# EAGLE schematic BISMILLAH PCG (EAGLE 9.6.2)
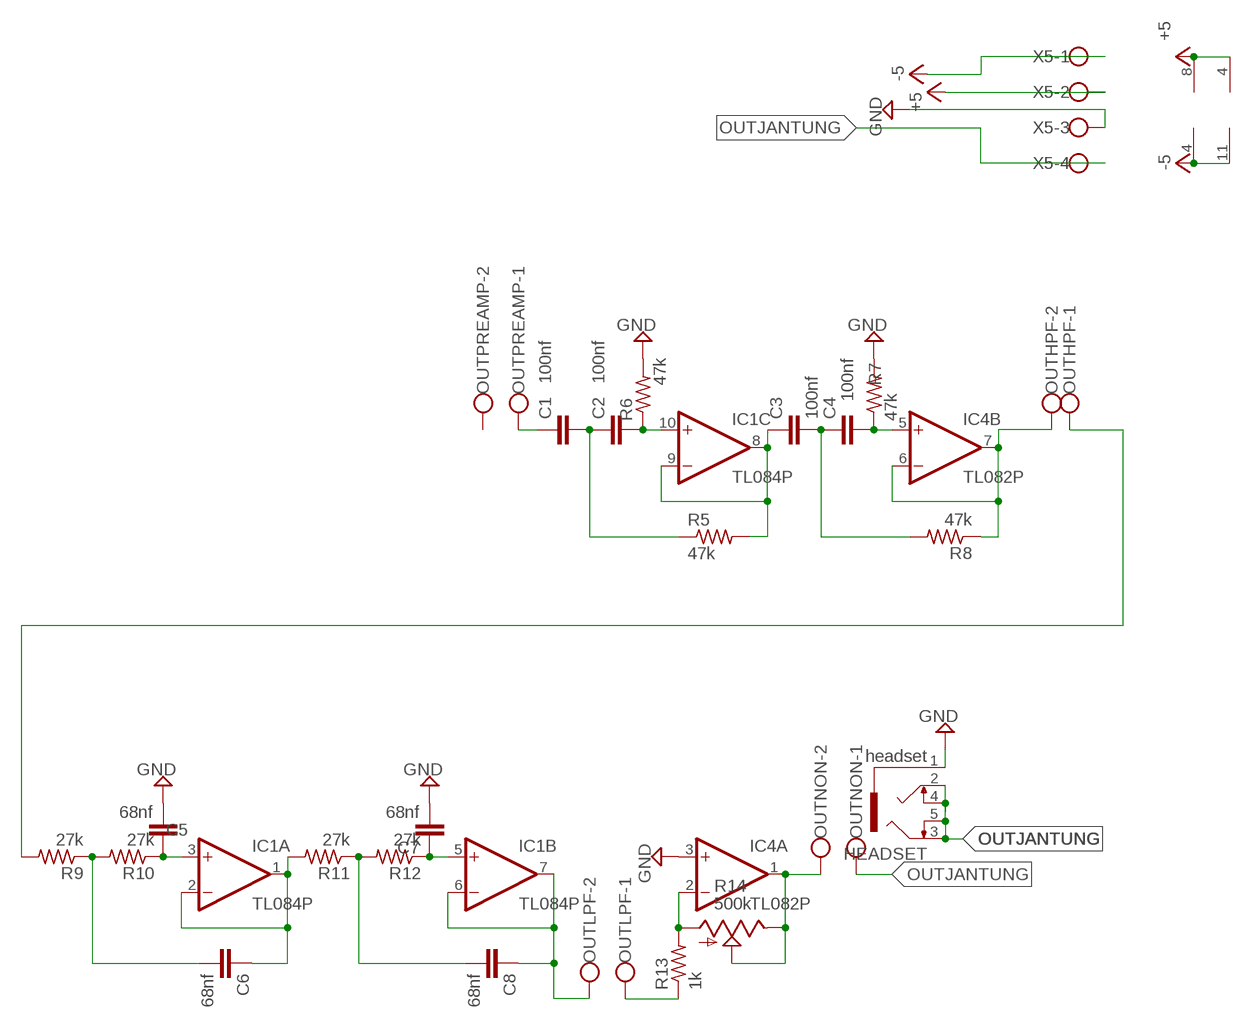
[diagram p0: schematic, sheet 1]

## Parts
C1  100nf  C-EU050-025X075  [C050-025X075]
C2  100nf  C-EU050-025X075  [C050-025X075]
C3  100nf  C-EU050-025X075  [C050-025X075]
C4  100nf  C-EU050-025X075  [C050-025X075]
C5  68nf  C-EU050-025X075  [C050-025X075]
C6  68nf  C-EU050-025X075  [C050-025X075]
C7  68nf  C-EU050-025X075  [C050-025X075]
C8  68nf  C-EU050-025X075  [C050-025X075]
HEADSET  headset  1503_09  [1503_09]
IC1  TL084P  [DIL14]
IC4  TL082P  [DIL08]
OUTHPF  W237-102  [W237-102]
OUTLPF  W237-102  [W237-102]
OUTNON  W237-102  [W237-102]
OUTPREAMP  W237-102  [W237-102]
R5  47k  R-US_0207/7  [0207/7]
R6  47k  R-US_0207/7  [0207/7]
R7  47k  R-US_0207/7  [0207/7]
R8  47k  R-US_0207/7  [0207/7]
R9  27k  R-US_0207/7  [0207/7]
R10  27k  R-US_0207/7  [0207/7]
R11  27k  R-US_0207/7  [0207/7]
R12  27k  R-US_0207/7  [0207/7]
R13  1k  R-US_0207/7  [0207/7]
R14  500k  TRIM_US-B64Y  [B64Y]
X5  W237-4  [W237-4]

## Nets
GND: C5.2 C7.2 HEADSET.1 IC4.3(A:+IN) R6.2 R7.2 X5.3
N$4: C1.1 OUTPREAMP.1
N$6: IC4.1(A:OUT) OUTNON.2 R14.E R14.S
N$7: C1.2 C2.1 R5.1
N$8: C2.2 IC1.10(C:+IN) R6.1
N$9: C3.1 IC1.8(C:OUT) IC1.9(C:-IN) R5.2
N$10: C3.2 C4.1 R8.2
N$11: C4.2 IC4.5(B:+IN) R7.1
N$12: IC4.6(B:-IN) IC4.7(B:OUT) OUTHPF.2 R8.1
N$13: C6.2 R9.1 R10.2
N$14: C5.1 IC1.3(A:+IN) R10.1
N$15: C6.1 IC1.1(A:OUT) IC1.2(A:-IN) R11.2
N$16: C8.2 R11.1 R12.2
N$17: C7.1 IC1.5(B:+IN) R12.1
N$18: C8.1 IC1.6(B:-IN) IC1.7(B:OUT) OUTLPF.2
N$19: IC4.2(A:-IN) R13.2 R14.A
N$20: OUTHPF.1 R9.2
N$23: OUTLPF.1 R13.1
OUTJANTUNG: HEADSET.2 HEADSET.3 HEADSET.4 HEADSET.5 OUTNON.1 X5.4
V-: IC1.11(P:V-) IC4.4(P:V-) X5.1 ; supply symbol labelled -5
VCC: IC1.4(P:V+) IC4.8(P:V+) X5.2 ; supply symbol labelled +5
Unconnected: IC1.12(D:+IN) IC1.13(D:-IN) IC1.14(D:OUT) OUTPREAMP.2

## Library data of the parts
C1-C8 = rcl:C-EU: CAPACITOR, European symbol; SPICEPREFIX: C
HEADSET = con-lumberg:1503_09: Jack connectors according to JISC 6560, 3.5 mm Klinkeneinbaukupplung nach JISC 6560, 3,5 mm, 3-polig/ stereo, abgewinkelte Ausführung, mit 2 Öffnern und Lötaugen, für Leiterplatten Rückseitenmontage Source: http://www.lumberg.com/Produkte/PDFs/1503_09.pdf; OC_FARNELL: 1243244; OC_NEWARK: unknown
IC1 = linear:TL084: OP AMP
IC4 = linear:TL082: OP AMP Data sheet <http://www.ti.com/lit/ds/symlink/tl084a . pdf>; DATA_SHEET: <a href="http://www.ti.com/lit/ds/symlink/tl084a.pdf"> Data sheet </a>
OUTHPF OUTLPF OUTNON OUTPREAMP = con-wago-500:W237-102: WAGO SCREW CLAMP; MPN: 237-102; OC_FARNELL: unknown; OC_NEWARK: 70K9898
R5-R13 = rcl:R-US_: RESISTOR, American symbol; SPICEPREFIX: R
R14 = pot:TRIM_US-: POTENTIOMETER
X5 = con-wago-500:W237-4: WAGO SCREW CLAMP; OC_FARNELL: unknown; OC_NEWARK: unknown